# Altium schematic sheet -LTC3406_电源.SchDoc
size A4
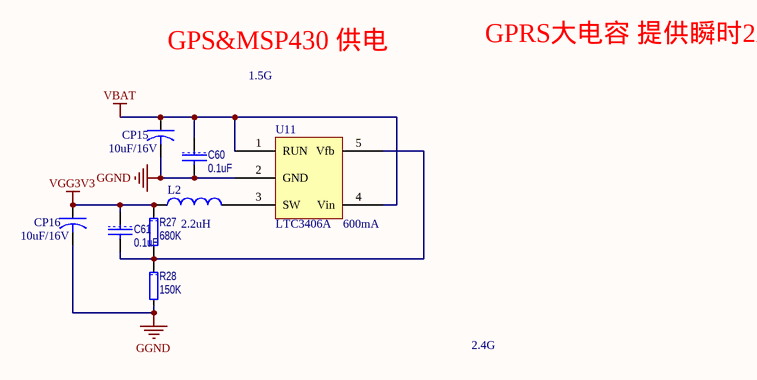
[diagram p0: -LTC3406_电源.SchDoc]

## Parts
C60  0.1uF  [1608[0603]]
C61  0.1uF  [1608[0603]]
CP15  10uF/16V  [3216[1206]]
CP16  10uF/16V  [3216[1206]]
L2  value 2.2uH  [INDP3232]  (hidden comment: CDRH2D18/HP 2R2)
R27  680K  [0603R]
R28  150K  [0603R]
U11  LTC3406A  [SOT23-5AN]

## Nets
GGND: C60.2 CP15.2 CP16.2 R28.2 U11.2(GND)
VBAT: C60.1 CP15.1 U11.1(RUN) U11.4(Vin)
VGG3V3: C61.1 CP16.1 L2.1 R27.1
NetC61_2: C61.2 R27.2 R28.1 U11.5(Vfb)
NetL2_2: L2.2 U11.3(SW)

## Notes on the sheet
- GPS&MSP430 供电
- GPRS大电容 提供瞬时2A大电流
- 1.5G
- (near U11) 600mA
- 2.4G

## Library data of the parts
C60 C61 = CAP: Capacitor; Manufacturer: TDK; Type: 无铅电容; Model: C0603X7R1H104K; Value: 0.1uF
CP15 CP16 = CAPACITOR: Tantalum Capacitor; Compy: TAJ; name: TAJ-A-106-M-010-R
L2 = Inductor: Code_IEC: 1005; parameters: 3.5A; 公司: SUMIDA; Published: 8-Jun-2000; LatestRevisionDate: 29-May-2009; LatestRevisionNote: IPC-7351 Footprint Added.; PackageReference: 0402-A; Publisher: Altium Limited; PackageDescription: Chip Inductor; Code_JEITA: 0402; Manufacturer: *
R27 = RES: Manufacturer: vishay; Model: CRCW0603680K0KKEDTR; Value: 680K; Type: 无铅电阻
R28 = RES: Manufacturer: vishay; Model: CRCW0603150K0KKEDTR; Value: 150K; Type: 无铅电阻
U11 = LTC3406A: POWER